# Altium schematic sheet CL21A106KAYNNNE.schdoc
size 127 x 101 mm
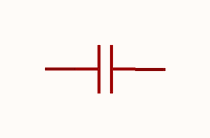
[diagram p0: CL21A106KAYNNNE.schdoc]

## Parts
C?  cl21a106kaynnne_c15850  [C0805]  (value not drawn)

## Nets

Not connected (* = marked no-connect by the designer): C? 1 2

## Library data of the parts
C? = cl21a106kaynnne_c15850: 容值:10uF;精度:±10%;额定电压:25V;温度系数:X5R;; Manufacturer: SAMSUNG(三星); AddInBom: yes; ModelId: 1ba041120af144c991958decab20d241; ModelName: C0805_L2.0-W1.3-H1.3; ModelTransform: 78.74,51.181,0,0,0,0,0,0.0005,0; Value: 10uF; Tolerance: ±10%; Voltage Rating: 25V; Temperature Coefficient: X5R; Symbol: CL21A106KAYNNNE; LCSC Part Name: 10uF ±10% 25V; SupplierPart: C15850; ManufacturerPart: CL21A106KAYNNNE; Supplier Footprint: 0805; JLCPCB Part Class: Basic Part; Datasheet: https://item.szlcsc.com/datasheet/CL21A106KAYNNNE/16532.html; Supplier: LCSC; ConvertToPcb: yes; FootprintName: C0805